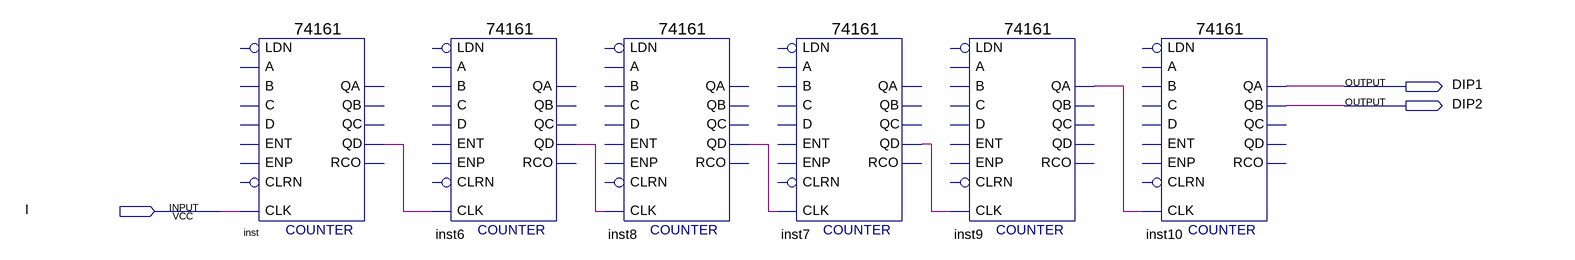
[diagram p0: schematic sheet]
// Quartus schematic COUNT.bdf as structural Verilog: 6 symbols, 3 pins
module COUNT (
  input  I,
  output DIP1,
  output DIP2
);

  wire inst6_qd, inst7_qd, inst8_qd, inst9_qa, inst_qd;

  \74161  inst (.CLK(I), .QD(inst_qd));  // open: CLRN, ENP, LDN, A, D, ENT, B, C, QC, QB, QA, RCO
  \74161  inst6 (.CLK(inst_qd), .QD(inst6_qd));  // open: CLRN, ENP, LDN, A, D, ENT, B, C, QC, QB, QA, RCO
  \74161  inst8 (.CLK(inst6_qd), .QD(inst8_qd));  // open: CLRN, ENP, LDN, A, D, ENT, B, C, QC, QB, QA, RCO
  \74161  inst7 (.CLK(inst8_qd), .QD(inst7_qd));  // open: CLRN, ENP, LDN, A, D, ENT, B, C, QC, QB, QA, RCO
  \74161  inst9 (.CLK(inst7_qd), .QA(inst9_qa));  // open: CLRN, ENP, LDN, A, D, ENT, B, C, QD, QC, QB, RCO
  \74161  inst10 (.CLK(inst9_qa), .QB(DIP2), .QA(DIP1));  // open: CLRN, ENP, LDN, A, D, ENT, B, C, QD, QC, RCO
endmodule
